# Altium schematic sheet 98 - MECH.SchDoc
size A4; DocumentNumber: 98; SheetNumber: 98; SchemaTitle: Mechanical

## Notes on the sheet
- Schema Title:
- Project:
- PCB Name:
- Author:
- PCB-No.:
- Revision:
- Co-Author:
- .
- x
- Customer:
- Reviewer:
- (C) Miromico - Gallusstrasse 4 - 8006 Zuerich
- Date:
- Time:
- Sheet:
- of
- Doc Name:
- A4